# Altium schematic sheet TopSheet.SchDoc
size A4; CompanyName: Technische Hochschule Nürnberg Georg Simon Ohm; Organization: UltraZohm; Address1: Kesslerplatz 12; Address2: 90489 Nürnberg; Address3: GERMANY; SheetNumber: 1; SheetTotal: 8; Website: www.ultrazohm.com
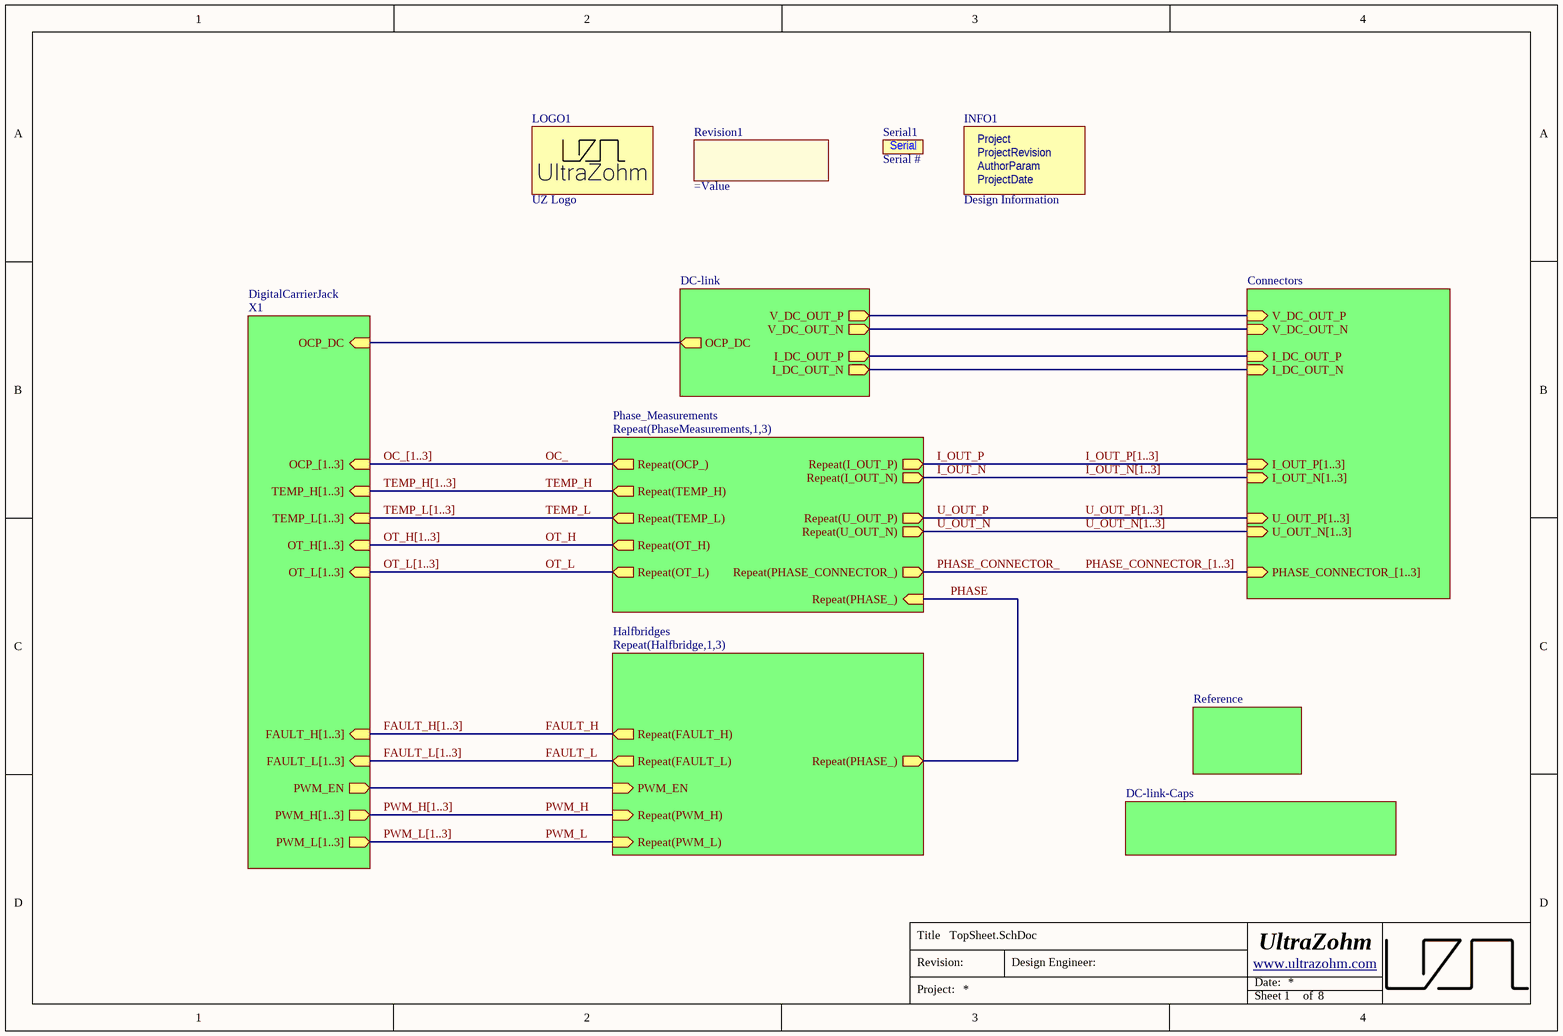
[diagram p0: TopSheet.SchDoc]

## Parts
INFO1  Design Information  [Design_info]  (no BOM)
LOGO1  UZ Logo  [UZ_Logo_small]  (no BOM)
Revision1  (no value)  [Designator:comment]  (no BOM)
Serial1  Serial #  [SERIAL]  (no BOM)

## Sub-sheets
DC-link-Caps = DC-link-Caps.SchDoc: no entries
Repeat(Halfbridge,1,3) = Halfbridges: Repeat(PWM_H) (in), Repeat(PWM_L) (in), Repeat(PHASE_) (out), PWM_EN (in), Repeat(FAULT_L) (out), Repeat(FAULT_H) (out)
Repeat(PhaseMeasurements,1,3) = Phase_Measurements: Repeat(I_OUT_P) (out), Repeat(I_OUT_N) (out), Repeat(U_OUT_P) (out), Repeat(U_OUT_N) (out), Repeat(OT_H) (out), Repeat(OT_L) (out), Repeat(TEMP_H) (out), Repeat(TEMP_L) (out), Repeat(PHASE_CONNECTOR_) (out), Repeat(PHASE_) (in), Repeat(OCP_) (out)
X1 = DigitalCarrierJack: PWM_H[1..3] (out), PWM_L[1..3] (out), OT_H[1..3] (in), OT_L[1..3] (in), TEMP_H[1..3] (in), TEMP_L[1..3] (in), FAULT_L[1..3] (in), FAULT_H[1..3] (in), OCP_[1..3] (in), OCP_DC (in), PWM_EN (out)
? = Connectors: I_DC_OUT_N (in), I_DC_OUT_P (in), I_OUT_P[1..3] (in), I_OUT_N[1..3] (in), U_OUT_P[1..3] (in), U_OUT_N[1..3] (in), V_DC_OUT_N (in), V_DC_OUT_P (in), PHASE_CONNECTOR_[1..3] (in)
? = Reference: no entries
? = DC-link: I_DC_OUT_N (out), I_DC_OUT_P (out), V_DC_OUT_N (out), V_DC_OUT_P (out), OCP_DC (out)

## Nets
FAULT_H: sheet Repeat(Halfbridge,1,3)/Repeat(FAULT_H)
FAULT_L: sheet Repeat(Halfbridge,1,3)/Repeat(FAULT_L)
I_OUT_N: sheet Repeat(PhaseMeasurements,1,3)/Repeat(I_OUT_N)
I_OUT_P: sheet Repeat(PhaseMeasurements,1,3)/Repeat(I_OUT_P)
OC_: sheet Repeat(PhaseMeasurements,1,3)/Repeat(OCP_)
OT_H: sheet Repeat(PhaseMeasurements,1,3)/Repeat(OT_H)
OT_L: sheet Repeat(PhaseMeasurements,1,3)/Repeat(OT_L)
PHASE: sheet Repeat(PhaseMeasurements,1,3)/Repeat(PHASE_), sheet Repeat(Halfbridge,1,3)/Repeat(PHASE_)
PHASE_CONNECTOR_: sheet Repeat(PhaseMeasurements,1,3)/Repeat(PHASE_CONNECTOR_)
PWM_H: sheet Repeat(Halfbridge,1,3)/Repeat(PWM_H)
PWM_L: sheet Repeat(Halfbridge,1,3)/Repeat(PWM_L)
TEMP_H: sheet Repeat(PhaseMeasurements,1,3)/Repeat(TEMP_H)
TEMP_L: sheet Repeat(PhaseMeasurements,1,3)/Repeat(TEMP_L)
U_OUT_N: sheet Repeat(PhaseMeasurements,1,3)/Repeat(U_OUT_N)
U_OUT_P: sheet Repeat(PhaseMeasurements,1,3)/Repeat(U_OUT_P)
(unnamed): sheet X1/OCP_DC, sheet /OCP_DC
(unnamed): sheet X1/PWM_EN, sheet Repeat(Halfbridge,1,3)/PWM_EN
(unnamed): sheet /I_DC_OUT_N, sheet /I_DC_OUT_N
(unnamed): sheet /I_DC_OUT_P, sheet /I_DC_OUT_P
(unnamed): sheet /V_DC_OUT_N, sheet /V_DC_OUT_N
(unnamed): sheet /V_DC_OUT_P, sheet /V_DC_OUT_P

## Buses and harness runs
bus FAULT_H[1..3] = sheet X1/FAULT_H[1..3]
bus FAULT_L[1..3] = sheet X1/FAULT_L[1..3]
bus I_OUT_N[1..3] = sheet /I_OUT_N[1..3]
bus I_OUT_P[1..3] = sheet /I_OUT_P[1..3]
bus OC_[1..3] = sheet X1/OCP_[1..3]
bus OT_H[1..3] = sheet X1/OT_H[1..3]
bus OT_L[1..3] = sheet X1/OT_L[1..3]
bus PHASE_CONNECTOR_[1..3] = sheet /PHASE_CONNECTOR_[1..3]
bus PWM_H[1..3] = sheet X1/PWM_H[1..3]
bus PWM_L[1..3] = sheet X1/PWM_L[1..3]
bus TEMP_H[1..3] = sheet X1/TEMP_H[1..3]
bus TEMP_L[1..3] = sheet X1/TEMP_L[1..3]
bus U_OUT_N[1..3] = sheet /U_OUT_N[1..3]
bus U_OUT_P[1..3] = sheet /U_OUT_P[1..3]

## Notes on the sheet
- Title
- Revision:
- Design Engineer:
- Date:
- Project:
- Sheet
- of
- (in symbol Design Information) Project; ProjectRevision; AuthorParam; ProjectDate
- (in symbol SerialNumber) Serial

## Library data of the parts
INFO1 = Design Information: Manufacturer: UltraZohm; Created from: MGremer; Manufacturer Part Number: Design Information; PartID: 12; Created On: 11/3/2021 9:04:23 AM; ComponentLink1Description: https://docs.ultrazohm.com/; ComponentLink1URL: homepage; Component Type: Design Information; Last Updated: 11/3/2021 9:28:34 AM; Supplier 1: -; Supplier Part Number 1: -; Type: Design Information; Value: Design Information; Live Cycle Status: 1
LOGO1 = Logo small: Manufacturer: UltraZohm; Created from: MGremer; Created: Jan2021_Liegmann; Value: Logo; Manufacturer Part Number: Logo small; PartID: 10; Created On: 11/3/2021 9:04:23 AM; ComponentLink1Description: https://docs.ultrazohm.com/; ComponentLink1URL: homepage; Component Type: Logo; Last Updated: 11/3/2021 9:05:50 AM; Supplier 1: -; Supplier Part Number 1: -; Type: Logo; Live Cycle Status: 1
Revision1 = ProjectRevision: Value: =ProjectRevision; Created: 2020-01-08_Thilo_Wendt
Serial1 = SerialNumber: Empty serial number of the PCB. Can be used for manually writing the serial number